# EAGLE design Replica (EAGLE 6.1)
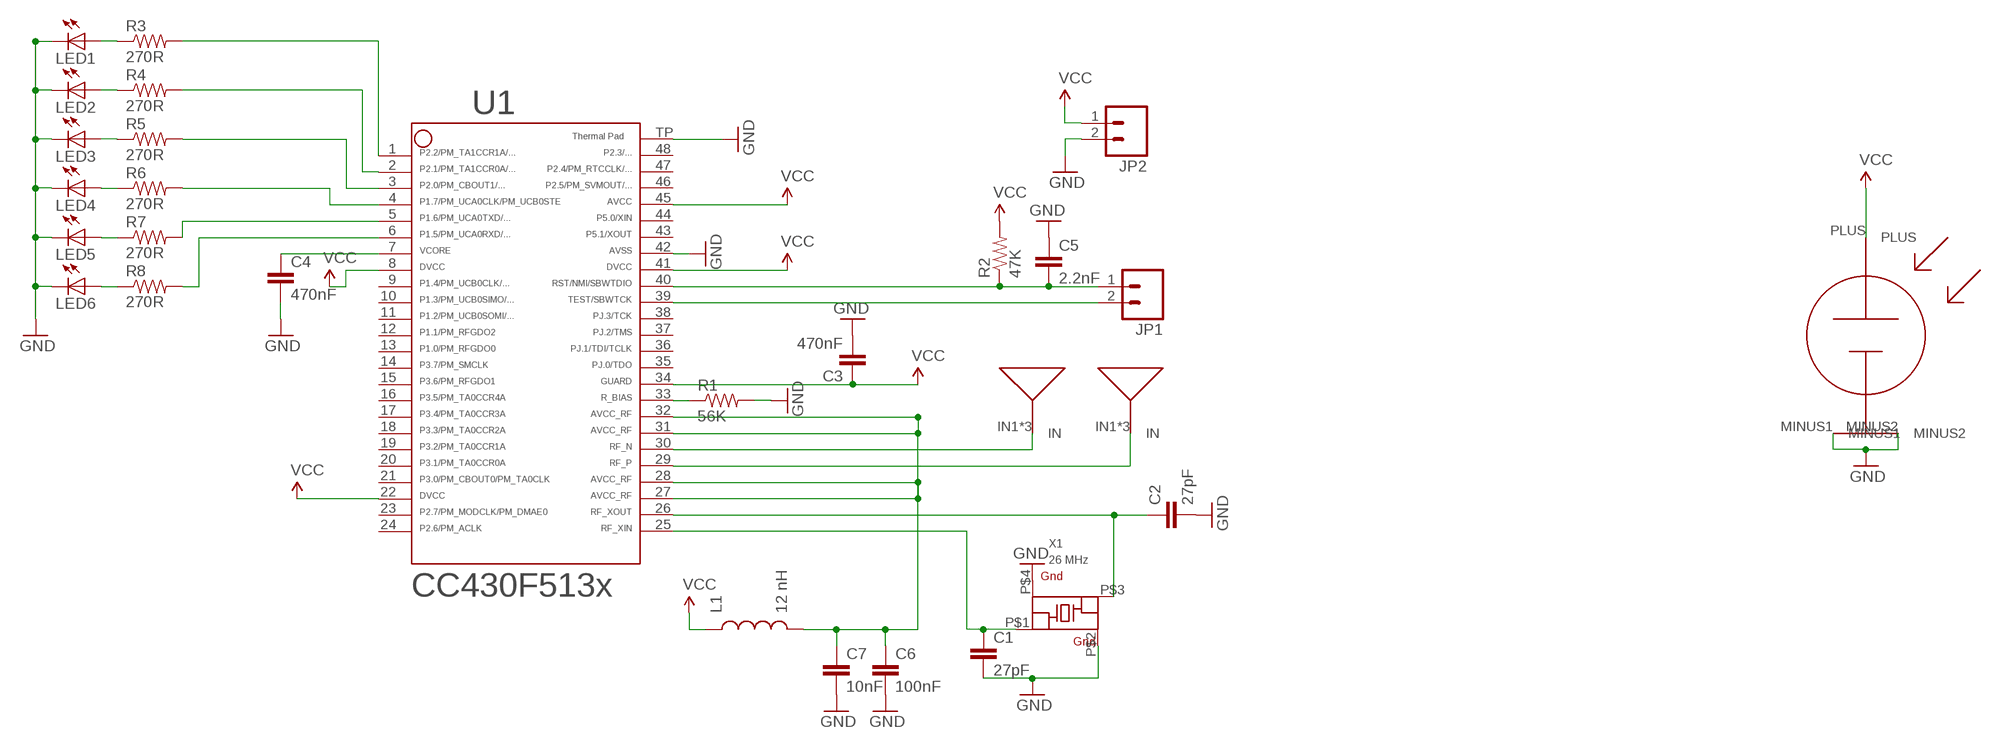
[diagram p0: schematic, sheet 1]

## Parts
ANT-N  ANTENNA  [ANTENNA]
ANT-P  ANTENNA  [ANTENNA]
C1  27pF  CAP0603-CAP  [0603-CAP]
C2  27pF  CAP0603-CAP  [0603-CAP]
C3  470nF  CAP0603-CAP  [0603-CAP]
C4  470nF  CAP0603-CAP  [0603-CAP]
C5  2.2nF  CAP0603-CAP  [0603-CAP]
C6  100nF  CAP0603-CAP  [0603-CAP]
C7  10nF  CAP0603-CAP  [0603-CAP]
JP1  M02PTH  [1X02]
JP2  M02PTH  [1X02]
L1  12 nH  INDUCTOR0603  [0603]
LED1  LED0603  [LED-0603]
LED2  LED0603  [LED-0603]
LED3  LED0603  [LED-0603]
LED4  LED0603  [LED-0603]
LED5  LED0603  [LED-0603]
LED6  LED0603  [LED-0603]
R1  56K  RESISTOR0603-RES  [0603-RES]
R2  47K  RESISTOR0603-RES  [0603-RES]
R3  270R  RESISTOR0603-RES  [0603-RES]
R4  270R  RESISTOR0603-RES  [0603-RES]
R5  270R  RESISTOR0603-RES  [0603-RES]
R6  270R  RESISTOR0603-RES  [0603-RES]
R7  270R  RESISTOR0603-RES  [0603-RES]
R8  270R  RESISTOR0603-RES  [0603-RES]
S1  TASC  [TASC]
U1  CC430F5137  CC430F513X---RGZ48  [RGZ48]
X1  26 MHz  ABM11_CERAMIC_SMD_CRYSTALABM11  [ABM11_CERAMIC-SMD-CRYSTAL]

## Nets
GND: C1.2 C2.2 C3.2 C4.2 C5.1 C6.2 C7.2 JP2.2 LED1.C LED2.C LED3.C LED4.C LED5.C LED6.C R1.2 S1.MINUS1 S1.MINUS2 U1.42 U1.TP X1.P$2(GROUND2) X1.P$4(GROUND4)
N$1: C2.1 U1.26 X1.P$3
N$2: C1.1 U1.25 X1.P$1
N$3: R1.1 U1.33
N$5: R4.2 U1.2
N$6: LED2.A R4.1
N$7: LED3.A R5.1
N$8: LED4.A R6.1
N$9: LED5.A R7.1
N$10: LED6.A R8.1
N$11: R3.2 U1.1
N$12: LED1.A R3.1
N$13: R5.2 U1.3
N$14: R6.2 U1.4
N$15: R7.2 U1.5
N$16: R8.2 U1.6
RFN: ANT-N.IN1(IN) ANT-N.IN2(IN) ANT-N.IN3(IN) U1.30
RFP: ANT-P.IN1(IN) ANT-P.IN2(IN) ANT-P.IN3(IN) U1.29
RST: C5.2 JP1.1 R2.1 U1.40
TEST: JP1.2 U1.39
VCC: C3.1 JP2.1 L1.1 R2.2 S1.PLUS U1.8 U1.22 U1.34 U1.41 U1.45
VCCRF: C6.1 C7.1 L1.2 U1.27 U1.28 U1.31 U1.32
VCORE: C4.1 U1.7
Unconnected: U1.9 U1.10 U1.11 U1.12 U1.13 U1.14 U1.15 U1.16 U1.17 U1.18 U1.19 U1.20 U1.21 U1.23 U1.24 U1.35 U1.36 U1.37 U1.38 U1.43 U1.44 U1.46 U1.47 U1.48

## Library data of the parts
ANT-N ANT-P = SpriteAntenna:ANTENNA
C1-C7 = SparkFun:CAP: Capacitor Standard 0603 ceramic capacitor, and 0.1" leaded capacitor.
JP1 JP2 = SparkFun:M02: Header 2 Standard 2-pin 0.1" header. Use with straight break away headers (SKU : PRT-00116), right angle break away headers (PRT-00553), swiss pins (PRT-00743), machine pins (PRT-00117), and female headers (PRT-00115). Molex polarized connector foot print use with SKU : PRT-08233 with associated crimp pins and housings.
L1 = SparkFun:INDUCTOR: Inductors Basic Inductor/Choke - 0603 and 1206. Footprints are not proven and vary greatly between part numbers.
LED1-LED6 = SparkFun:LED: LEDs Standard schematic elements and footprints for 5mm, 3mm, 1206, and 0603 sized LEDs. 5mm - Spark Fun Electronics SKU : COM-00529 (and others)
R1-R8 = SparkFun:RESISTOR: Resistor Basic schematic elements and footprints for 0603, 1206, and PTH resistors.
S1 = TASC:TASC
U1 = TI_MSP430_v16:CC430F513X---RGZ48: ***CC430F513X***RGZ48 ** ** Rev 1.0 ** 06/2010 * http://focus.ti.com/docs/prod/folders/print/cc430f5137.html
X1 = ABM11:ABM11_CERAMIC_SMD_CRYSTAL: ABM11 Crystal

## Board
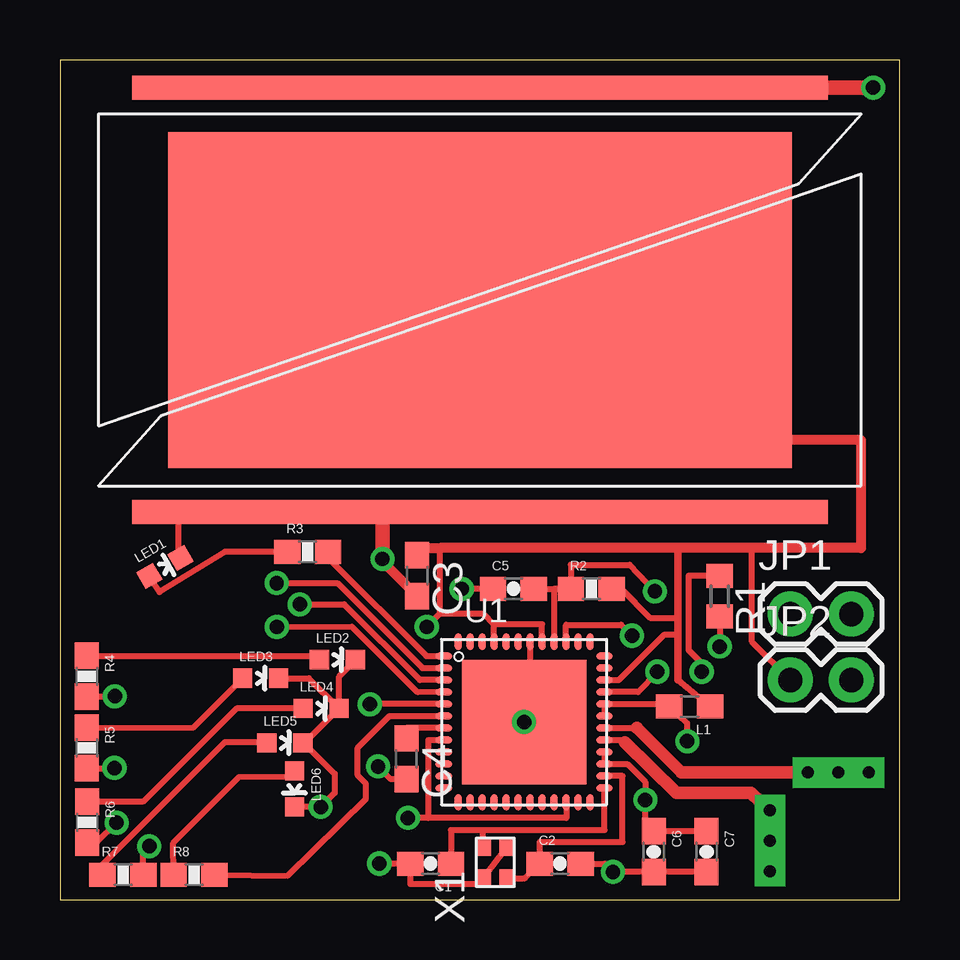
[diagram p1: board, top side]
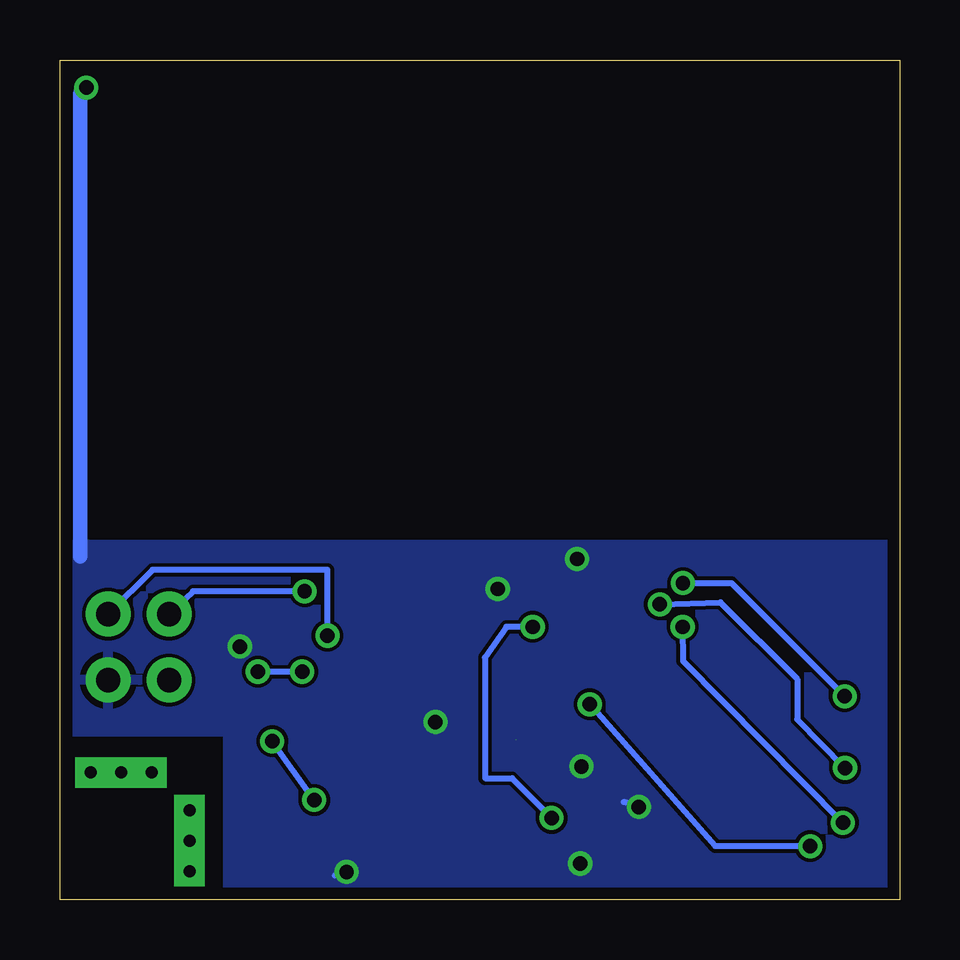
[diagram p2: board, bottom side, seen from below]

Size 35 x 35 mm. Coordinates in mm from the lower left corner, seen from the top.
Outline: 0,0 35,0 35,35 0,35 0,0
Copper layers (1*16): Top 0.0178mm / dielectric 59mil / Bottom 0.0178mm
Design rules "default": minimum track width 6mil, minimum drill 14mil, track to track 6mil, track to pad 6mil, pad to pad 6mil, via to via 6mil, smd to smd 6mil, copper to edge 20mil, drill to drill 16mil, minimum pad ring 8mil, minimum via ring 8mil, stop-mask expansion 3mil, vias tented up to drill 0mil, thermal gap 10mil

### Footprints (pad centres in the part's own frame; a part is rotated, then mirrored left to right if it is on the bottom)
ANTENNA = drill 0.5 pad 1.27 square: IN1 1.27,0; IN2 0,0; IN3 -1.27,0
0603-CAP = smd 1.1 x 1: 1 -0.85,0; 2 0.85,0
C0603 = smd 1.1 x 1: 1 -0.85,0; 2 0.85,0
1X02 = drill 1.016 pad 1.88: 1 0,0; 2 2.54,0
0603 = smd 1.1 x 1: 1 -0.85,0; 2 0.85,0
LED-0603 = smd 0.8 x 0.8: A 0,-0.75; C 0,0.75
R0603 = smd 1 x 1.1: 1 -0.85,0; 2 0.85,0
0603-RES = smd 1.1 x 1: 1 -0.85,0; 2 0.85,0
TASC = smd 29 x 1: MINUS1 15.9,16.6; MINUS2 15.9,-1.1 | smd 26 x 14: PLUS 15.9,7.75
RGZ48 = smd 0.7 x 0.3: 1 -3.35,2.75; 2 -3.35,2.25; 3 -3.35,1.75; 4 -3.35,1.25; 5 -3.35,0.75; 6 -3.35,0.25; 7 -3.35,-0.25; 8 -3.35,-0.75; 9 -3.35,-1.25; 10 -3.35,-1.75; 11 -3.35,-2.25; 12 -3.35,-2.75; 25 3.35,-2.75; 26 3.35,-2.25; 27 3.35,-1.75; 28 3.35,-1.25; 29 3.35,-0.75; 30 3.35,-0.25; 31 3.35,0.25; 32 3.35,0.75; 33 3.35,1.25; 34 3.35,1.75; 35 3.35,2.25; 36 3.35,2.75 | smd 0.3 x 0.7: 13 -2.75,-3.35; 14 -2.25,-3.35; 15 -1.75,-3.35; 16 -1.25,-3.35; 17 -0.75,-3.35; 18 -0.25,-3.35; 19 0.25,-3.35; 20 0.75,-3.35; 21 1.25,-3.35; 22 1.75,-3.35; 23 2.25,-3.35; 24 2.75,-3.35; 37 2.75,3.35; 38 2.25,3.35; 39 1.75,3.35; 40 1.25,3.35; 41 0.75,3.35; 42 0.25,3.35; 43 -0.25,3.35; 44 -0.75,3.35; 45 -1.25,3.35; 46 -1.75,3.35; 47 -2.25,3.35; 48 -2.75,3.35 | smd 5.2 x 5.2: TP 0,0
ABM11_CERAMIC-SMD-CRYSTAL = smd 0.762 x 0.66: P$1 0.66,0.508; P$2 0.66,-0.508; P$3 -0.66,-0.508; P$4 -0.66,0.508

### Placement (x,y rotation side)
ANT-N  32.45,5.3 180 top
ANT-P  29.6,2.45 90 top
C1  15.45,1.5 180 top
C2  20.85,1.5 0 top
C3  470nF  [C0603]  14.88,13.5 270 top
C4  470nF  [C0603]  14.44,5.87 270 top
C5  18.9,12.95 0 top
C6  24.75,2 270 top
C7  26.95,2 270 top
JP1  30.45,11.9 0 top
JP2  30.45,9.15 0 top
L1  26.25,8.05 180 top
LED1  4.38,13.86 300 top
LED2  11.56,10 270 top
LED3  8.36,9.23 270 top
LED4  10.89,7.97 270 top
LED5  9.37,6.53 270 top
LED6  9.78,4.61 180 top
R1  56K  [R0603]  27.5,12.65 270 top
R2  22.15,12.95 0 top
R3  10.33,14.5 0 top
R4  1.12,9.31 270 top
R5  1.12,6.32 270 top
R6  1.13,3.23 270 top
R7  2.63,1.03 0 top
R8  5.59,1.03 0 top
S1  1.6,17.25 0 top
U1  19.35,7.4 0 top
X1  18.15,1.55 90 top

### Tracks (layer width: path | path; a pad name or v marks a point on that pad's centre or on a via)
GND  (via drill 0.6, 0.6 pad 0.25)
  Top 0.254: 13.44,16.1 9,16.05 5.02,16.05 4.95,16.05 4.95,14.24 LED1.C | C5.1 v16.75,12.95 | U1.42 19.6,7.75 U1.TP | R1.2 v27.5,10.55 | C7.2 C6.2 | C6.2 24.8,1.1 | C6.2 v23.05,1.15 22.7,1.5 C2.2 | X1.P$4 | X1.P$4 X1.P$2 | X1.P$4 17.65,0.65 14.6,0.65 C1.2 13.54,1.5 v13.31,1.5 | C4.2 13.79,5.02 v13.26,5.55 | LED4.C 11.64,9.3 LED2.C | LED5.C 10.21,6.53 | 10.21,6.53 LED4.C | LED3.C 10.38,9.23 LED4.C | LED6.C v10.87,3.86 11.46,4.45 11.46,5.25 10.21,6.5 10.21,6.53
  Top 0.406: S1.MINUS2 12.4,16.15 13.44,16.1 | v13.44,14.2 13.44,14.09 C3.2
  Top 0.61: 13.44,16.1 v13.44,14.2 | S1.MINUS1 v33.9,33.85
  Bottom 0.254: v16.75,12.95 16.4,13.05 16.95,12.7 | v23.05,1.15 23.55,1 | v13.31,1.5 12.99,1.38 13.23,1.41 | v10.87,3.86 11.51,4.06 | v13.26,5.55 13.14,5.51 13.27,5.64
  Bottom 0.61: 34.15,14.3 34.15,33.6 v33.9,33.85
  other vias: 19.35,7.4
  pour Bottom: 0,14.8 0,0 28,0 28,7 35,7 34.95,14.8
N$1
  Top 0.254: U1.26 23.45,5.15 23.45,2.4 20,2.4 C2.1 19.39,0.89 X1.P$3
N$2
  Top 0.254: 17.65,2.9 16.3,2.9 C1.1 | 17.65,2.9 22.7,2.9 U1.25 | X1.P$1 17.64,2.89 17.65,2.9
N$3  (via drill 0.6)
  Top 0.254: R1.1 26.2,13.5 26.2,10.4 26.75,9.85 v26.75,9.5 | U1.33 24.1,8.65 v24.9,9.5
  Bottom 0.254: v24.9,9.5 v26.75,9.5
N$5  (via drill 0.6)
  Top 0.254: R4.2 2.27,8.46 v2.29,8.47 | v9.03,13.2 11.57,13.2 15.11,9.65 U1.2
  Bottom 0.254: v9.03,13.2 7.01,13.2 v2.29,8.47
N$6
  Top 0.254: R4.1 10.64,10.16 LED2.A
N$7
  Top 0.254: R5.1 5.55,7.16 LED3.A
N$8
  Top 0.254: LED4.A 7.36,7.96 3.47,4.08 0.98,4.08 R6.1
N$9
  Top 0.254: LED5.A 8.61,6.55 6.9,6.55 6.88,6.57 1.72,1.4 R7.1
N$10
  Top 0.254: R8.1 4.72,2.36 7.47,5.11 9.77,5.13 LED6.A
N$11
  Top 0.254: U1.1 15.28,10.15 11.26,14.16 11.18,14.16 R3.2
N$12
  Top 0.254: LED1.A 4.15,12.81 6.88,14.49 6.87,14.5 R3.1
N$13  (via drill 0.6)
  Top 0.254: R5.2 2.21,5.47 v2.27,5.49 | v9.99,12.31 11.85,12.31 15.01,9.15 U1.3
  Bottom 0.254: v9.99,12.31 7.47,12.39 4.27,9.2 4.27,7.52 v2.27,5.49
N$14  (via drill 0.6)
  Top 0.254: v9.04,11.37 12.17,11.38 14.91,8.64 U1.4 | R6.2 1.54,2.38 v2.36,3.2
  Bottom 0.254: v9.04,11.37 9.03,9.94 v2.36,3.2
N$15  (via drill 0.6)
  Top 0.254: R7.2 3.48,2.01 v3.72,2.22 | U1.5 v12.92,8.15 v12.92,8.14
  Bottom 0.254: v3.72,2.22 7.68,2.22 v12.92,8.14
N$16
  Top 0.254: R8.2 9.49,0.99 12.75,4.2 12.75,4.83 12.41,5.17 12.41,6.33 13.73,7.64 U1.6
RFN
  Top 0.254: U1.30 24.05,7.15
  Top 0.53: ANT-N.IN3 ANT-N.IN2 ANT-N.IN1 25.9,5.3 24.05,7.15
RFP
  Top 0.254: 29.6,3.7 ANT-P.IN1 | U1.29 23.45,6.65 23.55,6.55
  Top 0.53: ANT-P.IN3 ANT-P.IN2 29.6,3.7 28.8,4.45 25.7,4.45 23.55,6.55
RST  (via drill 0.6)
  Top 0.254: R2.1 21.3,13 | C5.2 R2.1 | R2.1 21.3,13.95 23.75,13.95 v24.8,12.85 | R2.1 20.6,12.95 U1.40
  Bottom 0.254: v24.8,12.85 29.45,12.85 JP1.1
TEST  (via drill 0.6)
  Top 0.254: U1.39 21.1,11.45 23.4,11.45 v23.85,11
  Bottom 0.254: v23.85,11 23.85,13.75 31.14,13.75 JP1.2
VCC  (via drill 0.6)  (1 unrouted)
  Top 0.254: R2.2 23.4,12.95 24.6,11.75 25.65,11.75 25.75,11.85 | U1.45 18.1,11.47 | 15.85,11.93 15.85,14.65 | U1.41 20.1,11.47 18.1,11.47 | JP2.1 28.85,10.75 28.85,14.65 | 25.75,9.15 L1.1 | U1.34 23.3,9.15 25.2,11.05 25.7,11.05 25.75,11 | U1.22 21.11,3.4 15.35,3.4 | 15.35,3.4 15.35,6.66 U1.8 | 15.35,3.4 v14.5,3.4 | 15.85,11.93 17.65,11.93 18.1,11.47 | 15.85,11.93 v15.29,11.37
  Top 0.305: 25.75,14.65 25.75,11.85 25.75,11 25.75,9.15
  Top 0.406: S1.PLUS 17.5,19.15 33.4,19.15 33.4,14.65 28.85,14.65 25.75,14.65 15.85,14.65 15.85,14.66 14.88,14.66 C3.1 | C3.1
  Bottom 0.254: v15.29,11.37 16.4,11.37 17.29,10.08 17.27,5.05 16.15,5.05 v14.5,3.4
VCCRF  (via drill 0.6)
  Top 0.254: U1.32 U1.31 | 22.75,7.65 U1.32 | v26.15,6.6 26.15,7.35 L1.2 25.45,8.15 U1.32 | U1.28 U1.27 23.65,5.65 24.4,4.9 v24.4,4.15 24.4,2.75 C6.1 C7.1
  Bottom 0.254: v24.4,4.15 v26.15,6.6
VCORE
  Top 0.254: U1.7 14.44,7.15 C4.1